# Altium project Acoustics Board.PrjPcb
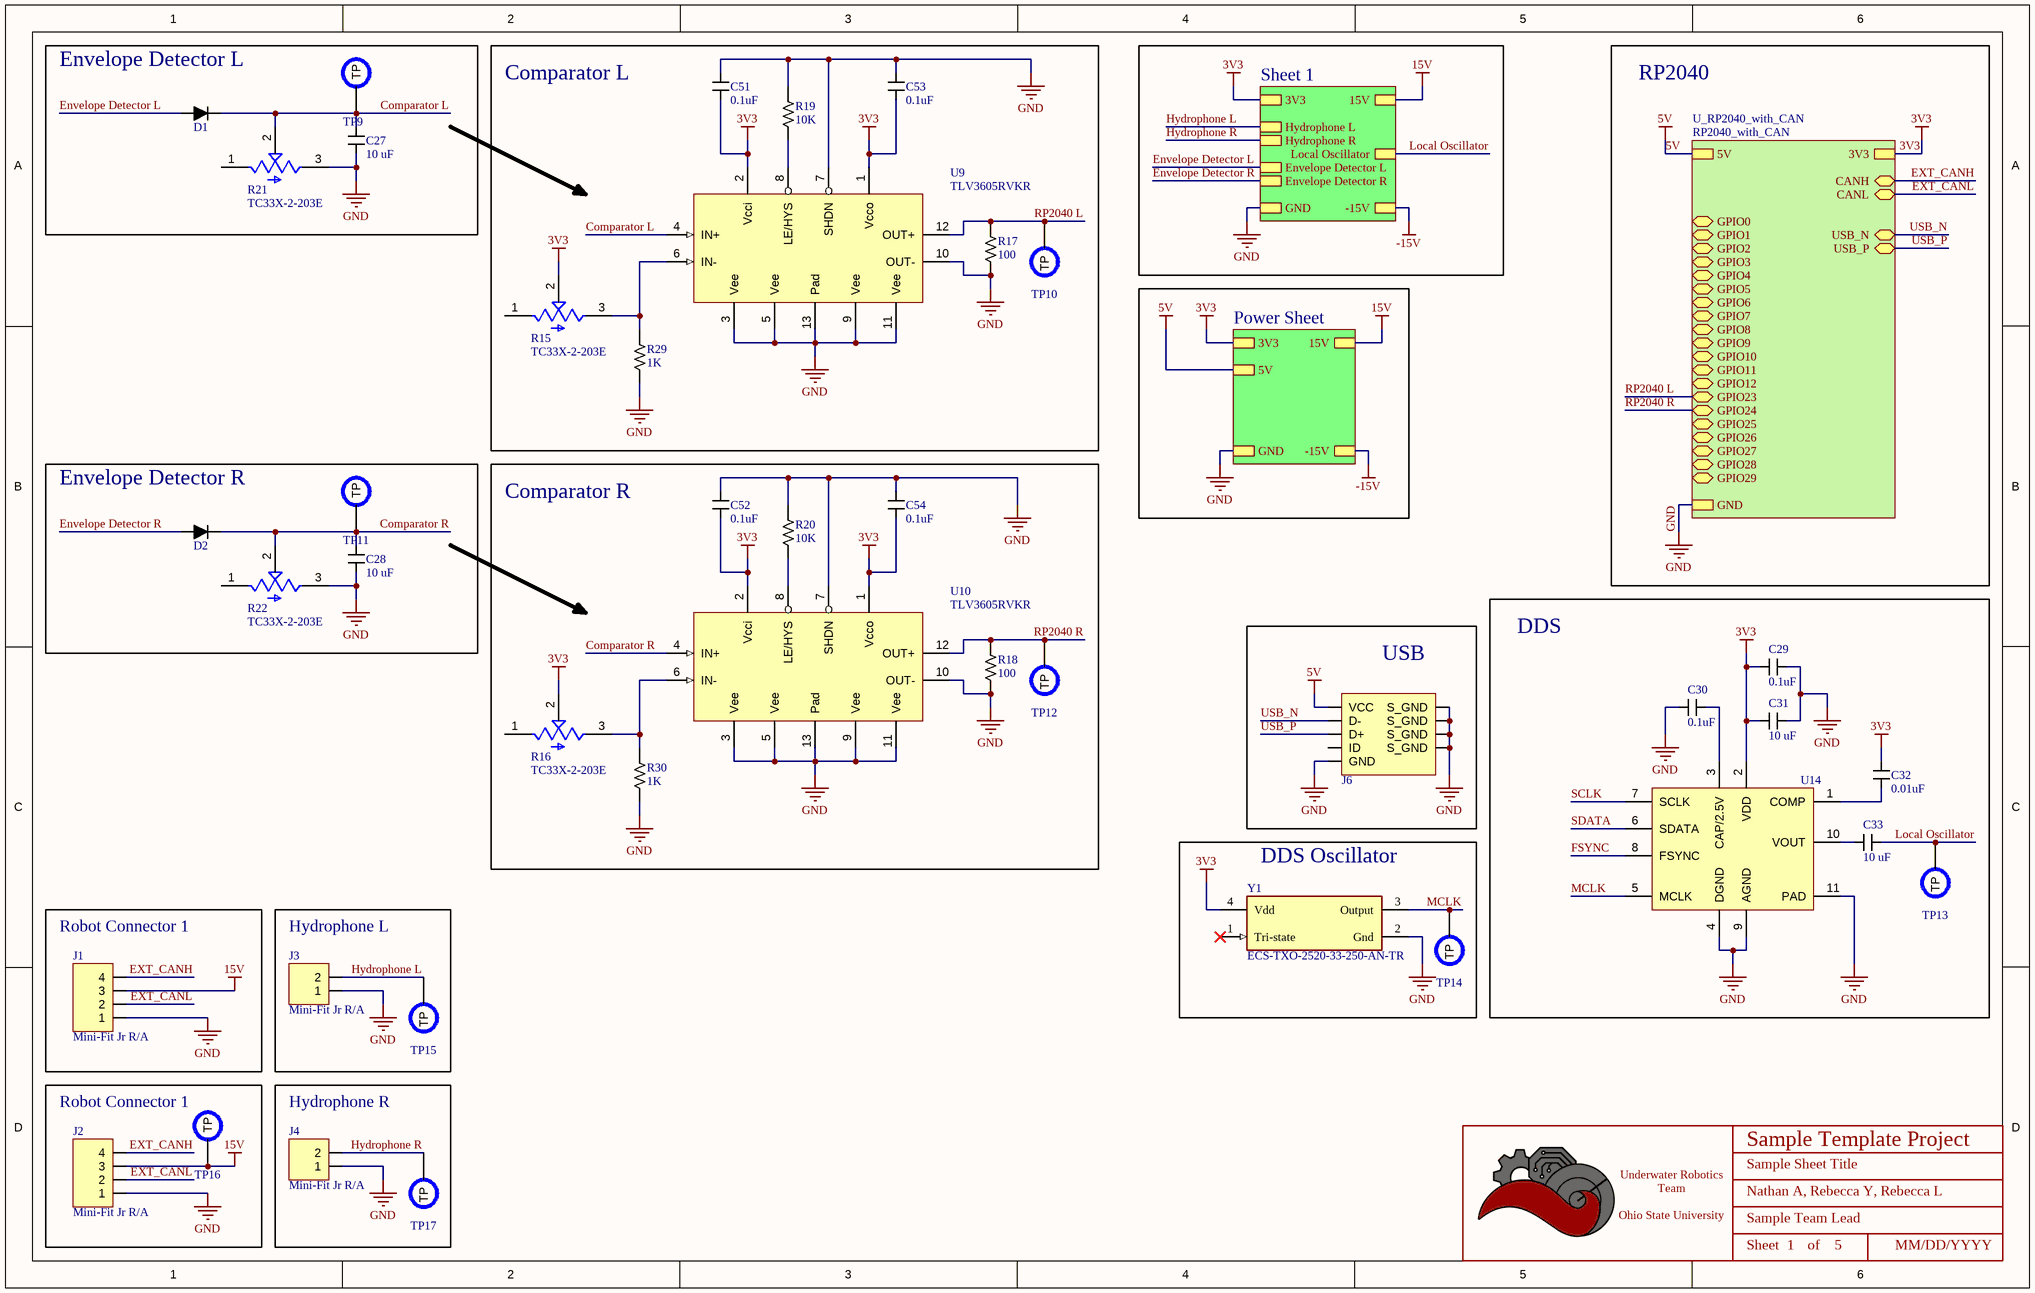
[diagram p0: Acoustics Board Pg. 2.SchDoc]
BoardRevision: 1.0; DateOfDesignReview: XX/XX/XXXX; ProjectTitle: Sample Template Project; TeamLead: Sample Team Lead
3 sheets, 145 parts. Net scope: strictly hierarchical (ports join the sheet entries above them; power ports are local).
Board file: Acoustics Board.PcbDoc
Sheets:
  Acoustics Board Pg. 2.SchDoc
    Sheet 1 = Acoustics Board Sheet 1.SchDoc
    Power Sheet = Acoustics Board Power.SchDoc

## Sheet Acoustics Board Pg. 2.SchDoc: Sample Sheet Title
size B; Date: MM/DD/YYYY; Author: Nathan A, Rebecca Y, Rebecca L; Organization: ORGANIZATION; Address1: ADDRESS 1; Address2: ADDRESS 2; Address3: ADDRESS 3; Address4: ADDRESS 4; Revision: -; SheetNumber: 1; SheetTotal: 5; ENG_APP_DATE: --/--/--; DSN_APP_DATE: --/--/--; CHK_APP_DATE: --/--/--

### Parts
(Parts that share a designator on the sheet are numbered #1, #2 ... from top to bottom, then left to right.)
*#1  Title_Block  [LOGO]  (value not drawn)  (graphical)
C27  Value (uF): 10 uF  [CAPACITOR_0603]  (hidden comment: 10uF Ceramic 6.3V)
C28  Value (uF): 10 uF  [CAPACITOR_0603]  (hidden comment: 10uF Ceramic 6.3V)
C29  value 0.1uF  [CAPACITOR_0603]  (hidden comment: 100nF Ceramic 6.3V)
C30  value 0.1uF  [CAPACITOR_0603]  (hidden comment: 100nF Ceramic 6.3V)
C31  Value (uF): 10 uF  [CAPACITOR_0603]  (hidden comment: 10uF Ceramic 6.3V)
C32  value 0.01uF  [CAPACITOR_0603]  (hidden comment: CL10B103KB8NNNC)
C33  Value (uF): 10 uF  [CAPACITOR_0603]  (hidden comment: 10uF Ceramic 6.3V)
C51  value 0.1uF  [CAPACITOR_0603]  (hidden comment: 100nF Ceramic 6.3V)
C52  value 0.1uF  [CAPACITOR_0603]  (hidden comment: 100nF Ceramic 6.3V)
C53  value 0.1uF  [CAPACITOR_0603]  (hidden comment: 100nF Ceramic 6.3V)
C54  value 0.1uF  [CAPACITOR_0603]  (hidden comment: 100nF Ceramic 6.3V)
D1  BAR9002ELE6327XTMA1  [DIODE_0402]  (value not drawn)
D2  BAR9002ELE6327XTMA1  [DIODE_0402]  (value not drawn)
J1  Mini-Fit Jr R/A  [CONN_MOLEX_MINIFIT JR_4 POS_R/A]
J2  Mini-Fit Jr R/A  [CONN_MOLEX_MINIFIT JR_4 POS_R/A]
J3  Mini-Fit Jr R/A  [CONN_MOLEX_MINIFIT JR_2 POS_R/A]
J4  Mini-Fit Jr R/A  [CONN_MOLEX_MINIFIT JR_2 POS_R/A]
J6  USB_MICRO R/A  [CONN_MINIUSB]  (value not drawn)
R15  TC33X-2-203E  [TRIM_TC33X-2-203E]
R16  TC33X-2-203E  [TRIM_TC33X-2-203E]
R17  Value  (Ohms): 100  [RESISTOR_0603]  (hidden comment: 100 Ohm 5% 1/8W)
R18  Value  (Ohms): 100  [RESISTOR_0603]  (hidden comment: 100 Ohm 5% 1/8W)
R19  Value  (Ohms): 10K  [RESISTOR_0603]  (hidden comment: 10k Ohm 5% 1/10W)
R20  Value  (Ohms): 10K  [RESISTOR_0603]  (hidden comment: 10k Ohm 5% 1/10W)
R21  TC33X-2-203E  [TRIM_TC33X-2-203E]
R22  TC33X-2-203E  [TRIM_TC33X-2-203E]
R29  Value  (Ohms): 1K  [RESISTOR_0603]  (hidden comment: 1k Ohm 5% 1/10W)
R30  Value  (Ohms): 1K  [RESISTOR_0603]  (hidden comment: 1k Ohm 5% 1/10W)
TP9  PCB Test Point  [TESTPOINT_1.2MM]  (value not drawn)  (no BOM)
TP10  PCB Test Point  [TESTPOINT_1.2MM]  (value not drawn)  (no BOM)
TP11  PCB Test Point  [TESTPOINT_1.2MM]  (value not drawn)  (no BOM)
TP12  PCB Test Point  [TESTPOINT_1.2MM]  (value not drawn)  (no BOM)
TP13  PCB Test Point  [TESTPOINT_1.2MM]  (value not drawn)  (no BOM)
TP14  PCB Test Point  [TESTPOINT_1.2MM]  (value not drawn)  (no BOM)
TP15  PCB Test Point  [TESTPOINT_1.2MM]  (value not drawn)  (no BOM)
TP16  PCB Test Point  [TESTPOINT_1.2MM]  (value not drawn)  (no BOM)
TP17  PCB Test Point  [TESTPOINT_1.2MM]  (value not drawn)  (no BOM)
U9  TLV3605RVKR  [TLV3605RVKR]
U10  TLV3605RVKR  [TLV3605RVKR]
U14  IC DDS 5MHZ 10BIT 10LFCSP  [CP-10-9]  (value not drawn)
Y1  ECS-TXO-2520-33-250-AN-TR  [FP-ECS-TXO-2520-MFG]

### Blocks framed on the sheet
Envelope Detector L: C27 D1 R21 TP9
Comparator L: C51 C53 R15 R17 R19 R29 TP10 U9
Envelope Detector R: C28 D2 R22 TP11
Comparator R: C52 C54 R16 R18 R20 R30 TP12 U10
DDS: C29-C33 TP13 U14
USB: J6
DDS Oscillator: TP14 Y1
Robot Connector 1: J1
Hydrophone L: J3 TP15
Robot Connector 1: J2 TP16
Hydrophone R: J4 TP17

### Sub-sheets
Power Sheet = Acoustics Board Power.SchDoc: 3V3, 15V, -15V, GND, 5V
Sheet 1 = Acoustics Board Sheet 1.SchDoc: Hydrophone L, Hydrophone R, Envelope Detector L, Envelope Detector R, 3V3, 15V, -15V, GND, Local Oscillator
U_RP2040_with_CAN = RP2040_with_CAN (file not in this document): USB_P (bidir), USB_N (bidir), 5V, CANH (bidir), CANL (bidir), GPIO0 (bidir), GPIO1 (bidir), GPIO2 (bidir), GPIO3 (bidir), GPIO4 (bidir), GPIO5 (bidir), GPIO6 (bidir), GPIO7 (bidir), GPIO8 (bidir), GPIO9 (bidir), GPIO10 (bidir), GPIO11 (bidir), GPIO12 (bidir), GPIO23 (bidir), GPIO24 (bidir), GPIO25 (bidir), GPIO26 (bidir), GPIO27 (bidir), GPIO28 (bidir), GPIO29 (bidir), 3V3, GND

### Nets
3V3: C29.2 C31.1 C32.1 C51.1 C52.1 C53.1 C54.1 R15.2(W) R16.2(W) U9.1(Vcco) U9.2(Vcci) U10.1(Vcco) U10.2(Vcci) U14.2(VDD) Y1.4(Vdd) ; sheet U_RP2040_with_CAN/3V3, sheet Sheet 1/3V3, sheet Power Sheet/3V3
5V: J6.1(VCC) ; sheet U_RP2040_with_CAN/5V, sheet Power Sheet/5V
15V: J1.3 J2.3 TP16.TP ; sheet Sheet 1/15V, sheet Power Sheet/15V
-15V: sheet Sheet 1/-15V, sheet Power Sheet/-15V
GND: C27.2 C28.2 C29.1 C30.1 C31.2 C51.2 C52.2 C53.2 C54.2 J1.1 J2.1 J3.1 J4.1 J6.5(GND) J6.6(S_GND) J6.7(S_GND) J6.8(S_GND) J6.9(S_GND) R17.2 R18.2 R19.1 R20.1 R21.3(CW) R22.3(CW) R29.2 R30.2 U9.3(Vee) U9.5(Vee) U9.7(SHDN) U9.9(Vee) U9.10(OUT-) U9.11(Vee) U9.13(Pad) U10.3(Vee) U10.5(Vee) U10.7(SHDN) U10.9(Vee) U10.10(OUT-) U10.11(Vee) U10.13(Pad) U14.4(DGND) U14.9(AGND) U14.11(PAD) Y1.2(Gnd) ; sheet U_RP2040_with_CAN/GND, sheet Sheet 1/GND, sheet Power Sheet/GND
Comparator L: C27.1 D1.2 R21.2(W) TP9.TP U9.4(IN+)
Comparator R: C28.1 D2.2 R22.2(W) TP11.TP U10.4(IN+)
Envelope Detector L: D1.1 ; sheet Sheet 1/Envelope Detector L
Envelope Detector R: D2.1 ; sheet Sheet 1/Envelope Detector R
EXT_CANH: J1.4 J2.4 ; sheet U_RP2040_with_CAN/CANH
EXT_CANL: J1.2 J2.2 ; sheet U_RP2040_with_CAN/CANL
FSYNC: U14.8(FSYNC)
Hydrophone L: J3.2 TP15.TP ; sheet Sheet 1/Hydrophone L
Hydrophone R: J4.2 TP17.TP ; sheet Sheet 1/Hydrophone R
Local Oscillator: C33.2 TP13.TP ; sheet Sheet 1/Local Oscillator
MCLK: TP14.TP U14.5(MCLK) Y1.3(Output)
RP2040 L: R17.1 TP10.TP U9.12(OUT+) ; sheet U_RP2040_with_CAN/GPIO23
RP2040 R: R18.1 TP12.TP U10.12(OUT+) ; sheet U_RP2040_with_CAN/GPIO24
SCLK: U14.7(SCLK)
SDATA: U14.6(SDATA)
USB_N: J6.2(D-) ; sheet U_RP2040_with_CAN/USB_N
USB_P: J6.3(D+) ; sheet U_RP2040_with_CAN/USB_P
NetC30_2: C30.2 U14.3(CAP/2.5V)
NetC32_2: C32.2 U14.1(COMP)
NetC33_1: C33.1 U14.10(VOUT)
NetR15_3: R15.3(CW) R29.1 U9.6(IN-)
NetR16_3: R16.3(CW) R30.1 U10.6(IN-)
NetR19_2: R19.2 U9.8(LE/HYS)
NetR20_2: R20.2 U10.8(LE/HYS)

Not connected (* = marked no-connect by the designer): J6 4(ID); R15 1(CCW); R16 1(CCW); R21 1(CCW); R22 1(CCW); Y1 1(Tri-state)*

### Notes on the sheet
- RP2040
- DWG. NO.
- REV.
- SHT.
- THIS DOCUMENT AND THE DATA DISCLOSED HEREIN OR HEREWITH IS THE PROPERTY OF ALTIUM LIMITED AND MAY BE FREELY DISTRIBUTED IN WHOLE. NO RIGHTS ARE RESERVED OR EXPRESS OR IMPLIED WARANTEE GIVEN.
- REVISION
- DESCRIPTION
- DATE
- APPROVED
- ENG:
- APPROVALS
- PROJECT
- DSN:
- CHK:
- REFERENCE DOCUMENTS
- PROJECT REVISION:
- TITLE
- DOCUMENT REVISION:
- DESIGN ITEM:
- BOM:
- FAB DWG:
- PCB DWG:
- ASSY DWG:
- SCALE:
- SIZE
- B
- CAGE CODE
- FILE NAME
- DWG NO.
- SHEET
- OF
- REV
- (in symbol Title_Block) Underwater Robotics Team / Ohio State University; Sheet; of

### Library data of the parts
*#1 = Title_Block: UWRT Schematic Title Block Template / Created June 2021, Dylan Trainor
C27 C28 C31 C33 = CAPACITOR_10uF_0603: Cap 10uF 6.3V +/-20% / Ceramic 0603; Made By: Flip B; ComponentLink1Description: Digikey; ComponentLink1URL: https://www.digikey.com/en/products/detail/samsung-electro-mechanics/CL10A106MQ8NNNC/3886777; Supplier 1: Digi-Key; Supplier Part Number 1: 1276-1119-1-ND; Tolerance: +/- 20%; Voltage: 6.3V
C29 C30 C51-C54 = CAPACITOR_0.1uF_0603: Cap 100nF 6.3V +/-10% / Ceramic 0603; Made By: Flip B; ComponentLink1Description: Datsheet; ComponentLink1URL: https://www.mouser.com/datasheet/2/212/KEM_C1002_X7R_SMD-1102033.pdf; Tolerance: +/- 10%; Voltage: 6.3V; Supplier 1: Digi-Key; Supplier Part Number 1: 399-15351-1-ND
C32 = CAPACITOR_0.01uF_0603_50V: 10000 pF ±10% 50V Ceramic Capacitor X7R 0603 (1608 Metric); Tolerance: +/- 10%; Voltage: 6.3V; Made By: Flip B; ComponentLink1Description: Datsheet; ComponentLink1URL: https://www.mouser.com/datasheet/2/212/KEM_C1002_X7R_SMD-1102033.pdf; Supplier 1: Arrow Electronics; Supplier Part Number 1: CL10B103KB8NNNC
D1 D2 = RF Diode 80V 100mA: RF Diode PIN - Single 80V 100 mA 250 mW PG-TSLP-2-19; Forward Current: 100mA; Voltage - Peak Reverse: 80V; Package: 0402
J1 J2 = CONN_MOLEX_MINIFIT JR_4POS_R/A: Molex Minifit Jr. 5569 / 4 Pos R/A Natural; Pitch: 4.2mm; Configuration: Right Angle; Current Per Pin: 13A; Number of Positions: 4; Supplier Part Number 1: WM13112-ND; Supplier 1: Digi-Key; Manufacturer: Molex; Color: Natural; Created By: Flip B; ComponentLink1Description: Datasheet; ComponentLink1URL: https://www.molex.com/pdm_docs/sd/026013115_sd.pdf; Series: Minifit Jr 5569
J3 J4 = CONN_MOLEX_MINIFIT JR_2POS_R/A: Molex Minifit Jr. 5569 / 2 Pos R/A Natural; Pitch: 4.2mm; Configuration: Right Angle; Current Per Pin: 13A; Number of Positions: 2; Manufacturer: Molex; Color: Natural; Created By: Robert P; ComponentLink1Description: Datasheet; ComponentLink1URL: https://www.molex.com/pdm_docs/sd/026013115_sd.pdf; Series: Minifit Jr 5569; Supplier 1: Digi-Key; Supplier Part Number 1: WM1351-ND
J6 = CONN_MICROUSB: Amphenol Micro USB-B / USB2.0 5 Pin Right Angle SMD; Pitch: 0.65mm; Current Per Pin: 1.8A; Number of Positions: 5; Manufacturer: Amphenol; Configuration: Right Angle; Color: Silver; Created By: Flip B; ComponentLink1Description: Datasheet; ComponentLink1URL: https://cdn.amphenol-icc.com/media/wysiwyg/files/documentation/datasheet/inputoutput/io_usb_micro.pdf?__cf_chl_jschl_tk__=05693735e19256298f6ef6ca2bb2e65c376a4f56-1625503833-0-Abitsb0-ufjOXJYs_S3J3r2iTn-nObalbmXUksF1VvO_h_WEmRdMlUD1I8-hmWSEVWzY1pirKnrPZWfgY3851qyBZe5ZvnNQePLGIzUgdEIQBVUyW36RsbYpDLEWxJ4horD-5gChFgobLYqwmG5aHl0E8lIn_twwPPrOxilK2gP0q9t_CNOs_u5fMqXvXUrlsOv8tIE2NRlu6NVP8qtkL2GjhlkeTUbDMF8WvvpPDTFOgvZ4Y16Ej8F8AhWos88mo5B1HssXozw0XrkJQIqERITUu6rqloz9kf4ZzhBHtDAt-IkiAFY_Ds9SW8FYKKTtINJVpHZQ6Gyu1FFM4Dc9MO0maE8_mmNcwlxqyRoRk_MPWW8VyByXWM5RSp52jteRKw7FeI9WIYvCbPAOy0Eyib-aseIQsnGbglBcUY6_2xp8GYaJM38H3dNvBPsSOfJBPndKedwKHllxjkucXn6xsN0sDXkpGN-cu8_2bDTJ0g-uUucKSCooYX-ApSDNGpkA_p9zv1SOAD8c0zaZVmtiBsN75QpVz2rzq9_BFxOywPvR; Series: 10118192; Supplier 1: Digi-Key; Supplier Part Number 1: 609-4613-1-ND
R15 R16 R21 R22 = TC33X-2-203E: 20 kOhms 0.1W, 1/10W J Lead Surface Mount Trimmer Potentiometer Cermet 1 Turn Top Adjustment; MF: Bourns; Value: *; SnapEDA_Link: https://www.snapeda.com/parts/TC33X-2-203E/Bourns/view-part/312812/?ref=snap; Check_prices: https://www.snapeda.com/parts/TC33X-2-203E/Bourns/view-part/312812/?ref=eda; Digi-Key_Part_Number: TC33X-2-203ECT-ND; Purchase-URL: https://pricing.snapeda.com/search/part/TC33X-2-203E/?ref=eda; Package: 1608 Bourns; MP: TC33X-2-203E
R17 R18 = RESISTOR_100_0603_1: RES 100 OHM 5% 1/8W 0603; Tolerance: +/- 5%; Made By: Flip B; ComponentLink1Description: Digikey; ComponentLink1URL: https://www.digikey.com/en/products/detail/koa-speer-electronics-inc/RK73B1JTTD101J/9844701; Wattage: 1/8W
R19 R20 = RESISTOR_10K_0603: RES 10k OHM 5% 1/10W 0603; Tolerance: +/- 5%; Wattage: 1/8W; Made By: Robert Pafford; ComponentLink1Description: Datasheet; ComponentLink1URL: https://www.bourns.com/docs/product-datasheets/CRxxxxx.pdf; Supplier: Digikey; Digikey Part Numer: CR0603-JW-104ELFTR-ND; Supplier 1: Digi-Key; Supplier Part Number 1: 2019-RK73B1JTTD103JCT-ND
R29 R30 = RESISTOR_1K_0.5%_0603: RES 1k OHM 0.5% 1/10W 0603; Tolerance: +/- 0.5%; Made By: Robert Pafford; Wattage: 1/10W; Supplier: Digikey; Digikey Part Numer: CR0603-JW-104ELFTR-ND; Supplier 1: Digi-Key; Supplier Part Number 1: 749-1693-1-ND
TP9-TP17 = TESTPOINT: Made By: Robert Pafford
U9 U10 = TLV3605RVKR: IC COMPARATOR 1 GEN PUR 12WQFN; Manufacturer: Texas Instruments; Supply Voltage: 2.4V ~ 5.5V; PartNumber: TLV3605RVKR; Created By: Nathan Ayer; ComponentLink1Description: Digi-Key; ComponentLink1URL: https://www.digikey.com/en/products/detail/texas-instruments/TLV3605RVKR/14123952
U14 = AD9837ACPZ: Direct Digital Synthesis IC 10 b 5 MHz 28 b Tuning 10-LFCSP-WD (3x3)
Y1 = CMP-40224-000034-1: XTAL OSC TCXO 25.0000MHZ HCMOS; RoHS Compliant: Yes

## Sheet Acoustics Board Sheet 1.SchDoc: Sample Sheet Title
size B; Date: 10/22/2023; Author: Sample Author; Organization: ORGANIZATION; Address1: ADDRESS 1; Address2: ADDRESS 2; Address3: ADDRESS 3; Address4: ADDRESS 4; Revision: -; SheetNumber: 2; SheetTotal: 5; ENG_APP_DATE: --/--/--; DSN_APP_DATE: --/--/--; CHK_APP_DATE: --/--/--
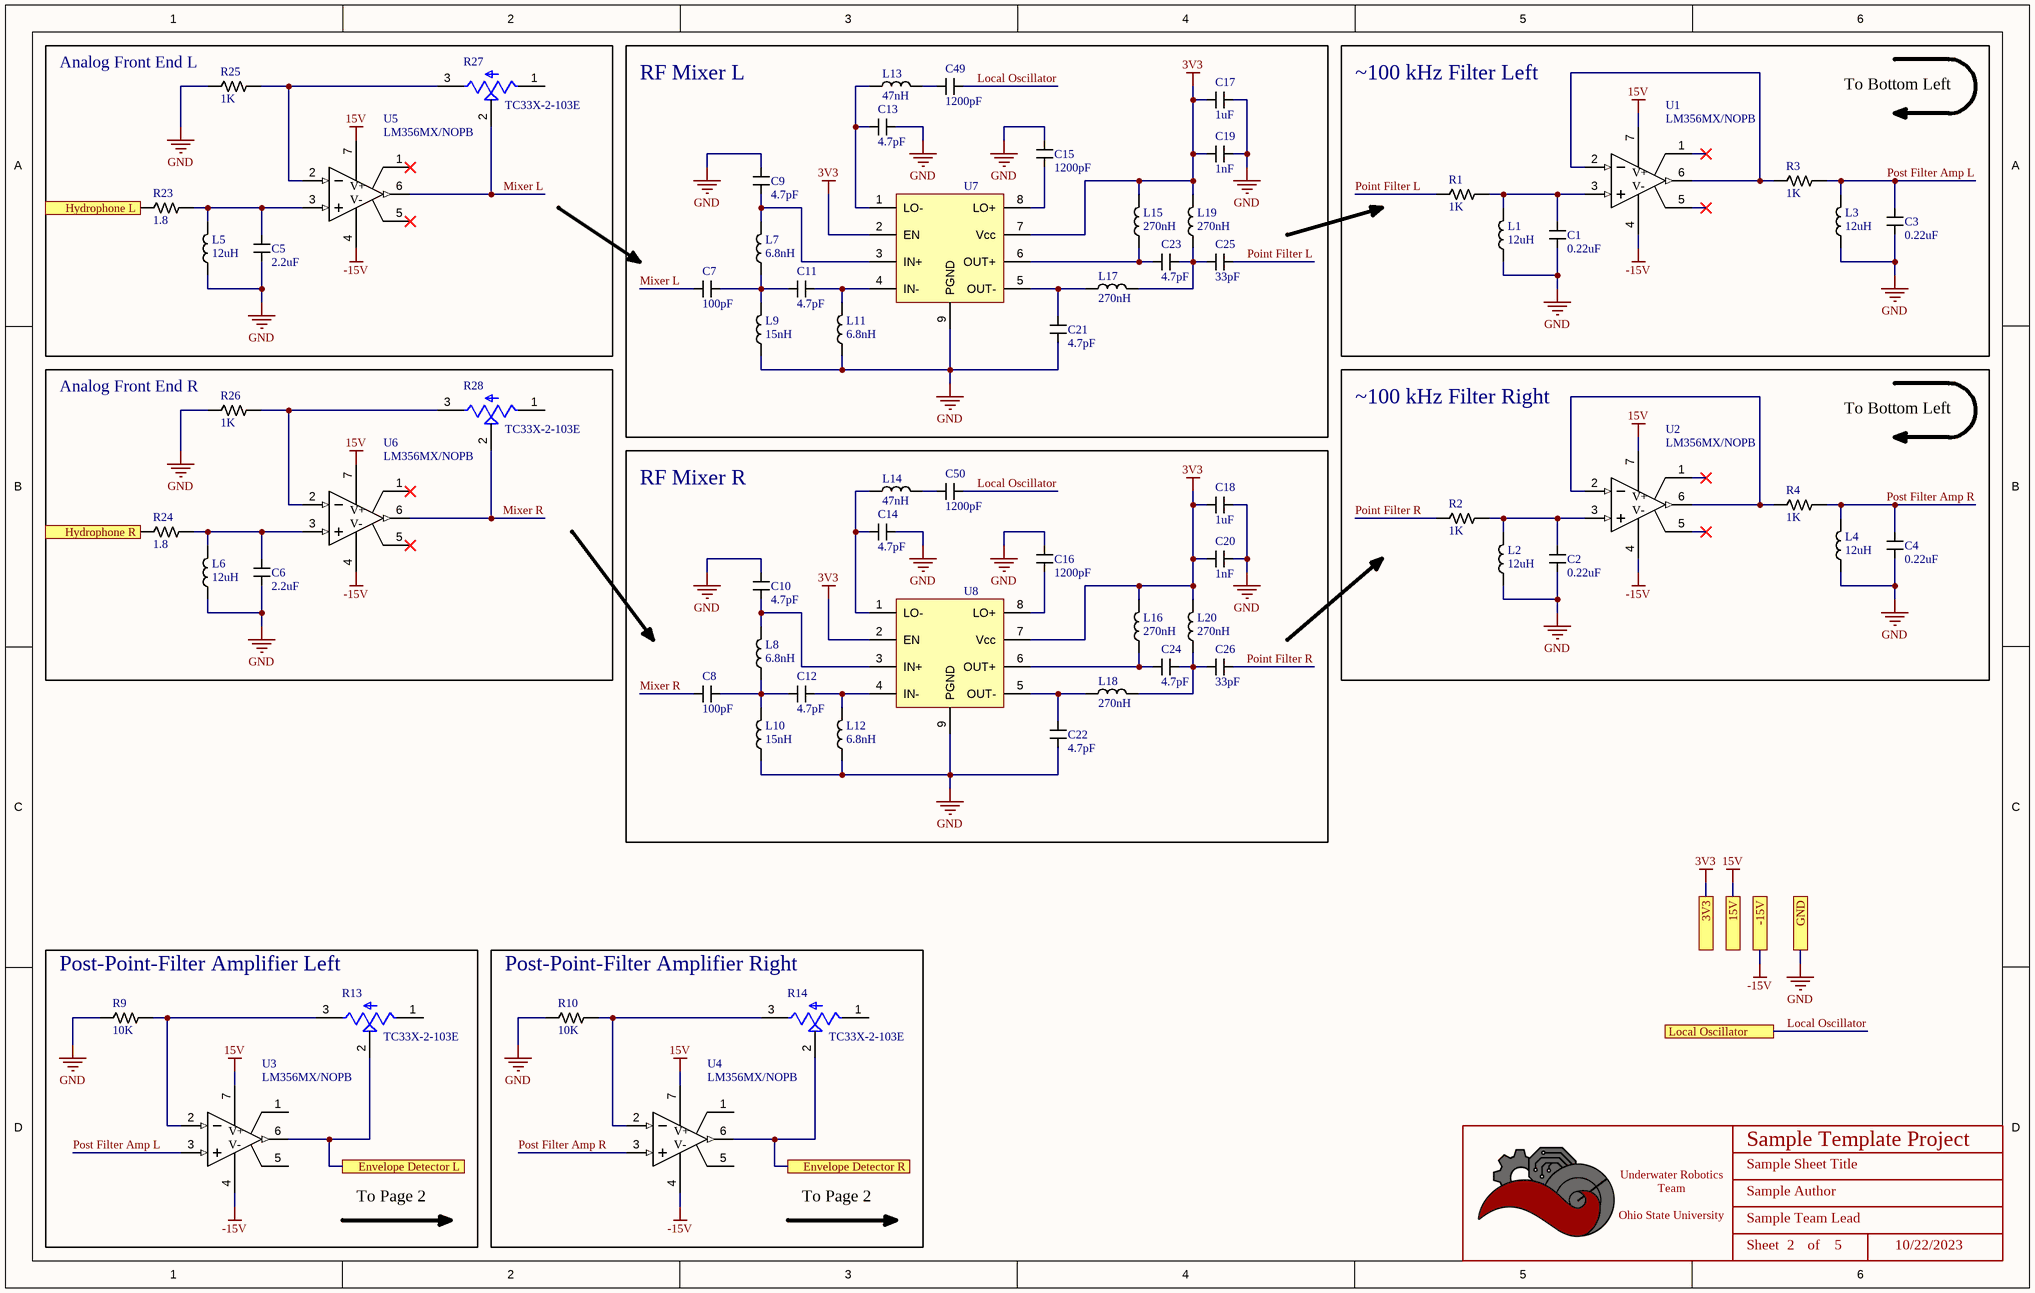
[diagram p1: Acoustics Board Sheet 1.SchDoc]

### Parts
(Parts that share a designator on the sheet are numbered #1, #2 ... from top to bottom, then left to right.)
*#2  Title_Block  [LOGO]  (value not drawn)  (graphical)
C1  value 0.22uF  [CAPACITOR_0603]  (hidden comment: 0.22uF Ceramic 16V)
C2  value 0.22uF  [CAPACITOR_0603]  (hidden comment: 0.22uF Ceramic 16V)
C3  value 0.22uF  [CAPACITOR_0603]  (hidden comment: 0.22uF Ceramic 16V)
C4  value 0.22uF  [CAPACITOR_0603]  (hidden comment: 0.22uF Ceramic 16V)
C5  value 2.2uF  [CAPACITOR_0603]  (hidden comment: 22uF Ceramic)
C6  value 2.2uF  [CAPACITOR_0603]  (hidden comment: 22uF Ceramic)
C7  value 100pF  [CAPACITOR_0402]  (hidden comment: 100pF Ceramic 25V)
C8  value 100pF  [CAPACITOR_0402]  (hidden comment: 100pF Ceramic 25V)
C9  value 4.7pF  [CAPACITOR_0402]  (hidden comment: CAP CER 4.7PF 50V C0G/NP0 0402)
C10  value 4.7pF  [CAPACITOR_0402]  (hidden comment: CAP CER 4.7PF 50V C0G/NP0 0402)
C11  value 4.7pF  [CAPACITOR_0402]  (hidden comment: CAP CER 4.7PF 50V C0G/NP0 0402)
C12  value 4.7pF  [CAPACITOR_0402]  (hidden comment: CAP CER 4.7PF 50V C0G/NP0 0402)
C13  value 4.7pF  [CAPACITOR_0402]  (hidden comment: CAP CER 4.7PF 50V C0G/NP0 0402)
C14  value 4.7pF  [CAPACITOR_0402]  (hidden comment: CAP CER 4.7PF 50V C0G/NP0 0402)
C15  value 1200pF  [CAPACITOR_0402]  (hidden comment: 1200pF Ceramic 50V)
C16  value 1200pF  [CAPACITOR_0402]  (hidden comment: 1200pF Ceramic 50V)
C17  value 1uF  [CAPACITOR_0603]  (hidden comment: 1uF Ceramic 25V)
C18  value 1uF  [CAPACITOR_0603]  (hidden comment: 1uF Ceramic 25V)
C19  value 1nF  [CAPACITOR_0603]  (hidden comment: 1000pF Ceramic 50V)
C20  value 1nF  [CAPACITOR_0603]  (hidden comment: 1000pF Ceramic 50V)
C21  value 4.7pF  [CAPACITOR_0402]  (hidden comment: CAP CER 4.7PF 50V C0G/NP0 0402)
C22  value 4.7pF  [CAPACITOR_0402]  (hidden comment: CAP CER 4.7PF 50V C0G/NP0 0402)
C23  value 4.7pF  [CAPACITOR_0402]  (hidden comment: CAP CER 4.7PF 50V C0G/NP0 0402)
C24  value 4.7pF  [CAPACITOR_0402]  (hidden comment: CAP CER 4.7PF 50V C0G/NP0 0402)
C25  value 33pF  [CAPACITOR_0603]  (hidden comment: CAP CER 33PF 250V C0G/NP0 0603)
C26  value 33pF  [CAPACITOR_0603]  (hidden comment: CAP CER 33PF 250V C0G/NP0 0603)
C49  value 1200pF  [CAPACITOR_0402]  (hidden comment: 1200pF Ceramic 50V)
C50  value 1200pF  [CAPACITOR_0402]  (hidden comment: 1200pF Ceramic 50V)
L1  value 12uH  [INDUCTOR_0603]  (hidden comment: FIXED IND 12UH 10MA 1.8 OHM SMD)
L2  value 12uH  [INDUCTOR_0603]  (hidden comment: FIXED IND 12UH 10MA 1.8 OHM SMD)
L3  value 12uH  [INDUCTOR_0603]  (hidden comment: FIXED IND 12UH 10MA 1.8 OHM SMD)
L4  value 12uH  [INDUCTOR_0603]  (hidden comment: FIXED IND 12UH 10MA 1.8 OHM SMD)
L5  value 12uH  [INDUCTOR_0603]  (hidden comment: FIXED IND 12UH 10MA 1.8 OHM SMD)
L6  value 12uH  [INDUCTOR_0603]  (hidden comment: FIXED IND 12UH 10MA 1.8 OHM SMD)
L7  value 6.8nH  [INDUCTOR_0402]  (hidden comment: FIXED IND 6.8NH 250MA 320MOHM SM)
L8  value 6.8nH  [INDUCTOR_0402]  (hidden comment: FIXED IND 6.8NH 250MA 320MOHM SM)
L9  value 15nH  [INDUCTOR_0402]  (hidden comment: FIXED IND 15NH 250MA 600MOHM SMD)
L10  value 15nH  [INDUCTOR_0402]  (hidden comment: FIXED IND 15NH 250MA 600MOHM SMD)
L11  value 6.8nH  [INDUCTOR_0402]  (hidden comment: FIXED IND 6.8NH 250MA 320MOHM SM)
L12  value 6.8nH  [INDUCTOR_0402]  (hidden comment: FIXED IND 6.8NH 250MA 320MOHM SM)
L13  value 47nH  [INDUCTOR_0402]  (hidden comment: FIXED IND 47NH 200MA 1.1 OHM SMD)
L14  value 47nH  [INDUCTOR_0402]  (hidden comment: FIXED IND 47NH 200MA 1.1 OHM SMD)
L15  value 270nH  [INDUCTOR_0402]  (hidden comment: FIXED IND 270NH 110MA 4.94OHM SM)
L16  value 270nH  [INDUCTOR_0402]  (hidden comment: FIXED IND 270NH 110MA 4.94OHM SM)
L17  value 270nH  [INDUCTOR_0402]  (hidden comment: FIXED IND 270NH 110MA 4.94OHM SM)
L18  value 270nH  [INDUCTOR_0402]  (hidden comment: FIXED IND 270NH 110MA 4.94OHM SM)
L19  value 270nH  [INDUCTOR_0402]  (hidden comment: FIXED IND 270NH 110MA 4.94OHM SM)
L20  value 270nH  [INDUCTOR_0402]  (hidden comment: FIXED IND 270NH 110MA 4.94OHM SM)
R1  Value  (Ohms): 1K  [RESISTOR_0603]  (hidden comment: 1.45k Ohm 0.1% 1/10W)
R2  Value  (Ohms): 1K  [RESISTOR_0603]  (hidden comment: 1.45k Ohm 0.1% 1/10W)
R3  Value  (Ohms): 1K  [RESISTOR_0603]  (hidden comment: 1.45k Ohm 0.1% 1/10W)
R4  Value  (Ohms): 1K  [RESISTOR_0603]  (hidden comment: 1.45k Ohm 0.1% 1/10W)
R9  Value  (Ohms): 10K  [RESISTOR_0603]  (hidden comment: 10k Ohm 0.5% 1/10W)
R10  Value  (Ohms): 10K  [RESISTOR_0603]  (hidden comment: 10k Ohm 0.5% 1/10W)
R13  TC33X-2-103E  [TRIM_TC33X-2-203E]
R14  TC33X-2-103E  [TRIM_TC33X-2-203E]
R23  Value  (Ohms): 1.8  [RESISTOR_0402]  (hidden comment: 2k Ohm 1% 1/16W)
R24  Value  (Ohms): 1.8  [RESISTOR_0402]  (hidden comment: 2k Ohm 1% 1/16W)
R25  Value  (Ohms): 1K  [RESISTOR_0603]  (hidden comment: 1k Ohm 5% 1/8W)
R26  Value  (Ohms): 1K  [RESISTOR_0603]  (hidden comment: 1k Ohm 5% 1/8W)
R27  TC33X-2-103E  [TRIM_TC33X-2-203E]
R28  TC33X-2-103E  [TRIM_TC33X-2-203E]
U1  LM356MX/NOPB  [SOIC-8]
U2  LM356MX/NOPB  [SOIC-8]
U3  LM356MX/NOPB  [SOIC-8]
U4  LM356MX/NOPB  [SOIC-8]
U5  LM356MX/NOPB  [SOIC-8]
U6  LM356MX/NOPB  [SOIC-8]
U7  LT5560EDD  [LT5560EDD]  (value not drawn)
U8  LT5560EDD  [LT5560EDD]  (value not drawn)

### Blocks framed on the sheet
Analog Front End L: C5 L5 R23 R25 R27 U5
RF Mixer L: C7 C9 C11 C13 C15 C17 C19 C21 C23 C25 C49 L7 L9 L11 L13 L15 L17 L19 U7
~100 kHz Filter Left: C1 C3 L1 L3 R1 R3 U1
Analog Front End R: C6 L6 R24 R26 R28 U6
~100 kHz Filter Right: C2 C4 L2 L4 R2 R4 U2
RF Mixer R: C8 C10 C12 C14 C16 C18 C20 C22 C24 C26 C50 L8 L10 L12 L14 L16 L18 L20 U8
Post-Point-Filter Amplifier Left: R9 R13 U3
Post-Point-Filter Amplifier Right: R10 R14 U4

### Ports
3V3, 15V, -15V, Envelope Detector L, Envelope Detector R, GND, Hydrophone L, Hydrophone R, Local Oscillator

### Nets
3V3: C17.2 C18.2 C19.2 C20.2 L15.1 L16.1 L19.1 L20.1 U7.2(EN) U7.7(Vcc) U8.2(EN) U8.7(Vcc) ; port 3V3
15V: U1.7(V+) U2.7(V+) U3.7(V+) U4.7(V+) U5.7(V+) U6.7(V+) ; port 15V
-15V: U1.4(V-) U2.4(V-) U3.4(V-) U4.4(V-) U5.4(V-) U6.4(V-) ; port -15V
GND: C1.2 C2.2 C3.2 C4.2 C5.2 C6.2 C9.1 C10.1 C13.1 C14.1 C15.1 C16.1 C17.1 C18.1 C19.1 C20.1 C21.2 C22.2 L1.2 L2.2 L3.2 L4.2 L5.2 L6.2 L9.2 L10.2 L11.2 L12.2 R9.2 R10.2 R25.2 R26.2 U7.9(PGND) U8.9(PGND) ; port GND
Envelope Detector L: R13.2(W) U3.6(OUT) ; port Envelope Detector L
Envelope Detector R: R14.2(W) U4.6(OUT) ; port Envelope Detector R
Hydrophone L: R23.2 ; port Hydrophone L
Hydrophone R: R24.2 ; port Hydrophone R
Local Oscillator: C49.1 C50.1 ; port Local Oscillator
Mixer L: C7.1 R27.2(W) U5.6(OUT)
Mixer R: C8.1 R28.2(W) U6.6(OUT)
Point Filter L: C25.1 R1.2
Point Filter R: C26.1 R2.2
Post Filter Amp L: C3.1 L3.1 R3.1 U3.3(IN+)
Post Filter Amp R: C4.1 L4.1 R4.1 U4.3(IN+)
NetC1_1: C1.1 L1.1 R1.1 U1.3(IN+)
NetC2_1: C2.1 L2.1 R2.1 U2.3(IN+)
NetC5_1: C5.1 L5.1 R23.1 U5.3(IN+)
NetC6_1: C6.1 L6.1 R24.1 U6.3(IN+)
NetC7_2: C7.2 C11.2 L7.2 L9.1
NetC8_2: C8.2 C12.2 L8.2 L10.1
NetC9_2: C9.2 L7.1 U7.3(IN+)
NetC10_2: C10.2 L8.1 U8.3(IN+)
NetC11_1: C11.1 L11.1 U7.4(IN-)
NetC12_1: C12.1 L12.1 U8.4(IN-)
NetC13_2: C13.2 L13.2 U7.1(LO-)
NetC14_2: C14.2 L14.2 U8.1(LO-)
NetC15_2: C15.2 U7.8(LO+)
NetC16_2: C16.2 U8.8(LO+)
NetC21_1: C21.1 L17.2 U7.5(OUT-)
NetC22_1: C22.1 L18.2 U8.5(OUT-)
NetC23_1: C23.1 C25.2 L17.1 L19.2
NetC23_2: C23.2 L15.2 U7.6(OUT+)
NetC24_1: C24.1 C26.2 L18.1 L20.2
NetC24_2: C24.2 L16.2 U8.6(OUT+)
NetC49_2: C49.2 L13.1
NetC50_2: C50.2 L14.1
NetR3_2: R3.2 U1.2(IN-) U1.6(OUT)
NetR4_2: R4.2 U2.2(IN-) U2.6(OUT)
NetR9_1: R9.1 R13.3(CW) U3.2(IN-)
NetR10_1: R10.1 R14.3(CW) U4.2(IN-)
NetR25_1: R25.1 R27.3(CW) U5.2(IN-)
NetR26_1: R26.1 R28.3(CW) U6.2(IN-)

Not connected (* = marked no-connect by the designer): R13 1(CCW); R14 1(CCW); R27 1(CCW); R28 1(CCW); U1 1(Balance)* 5(Balance)*; U2 1(Balance)* 5(Balance)*; U3 1(Balance) 5(Balance); U4 1(Balance) 5(Balance); U5 1(Balance)* 5(Balance)*; U6 1(Balance)* 5(Balance)*

### Notes on the sheet
- To Bottom Left
- To Page 2
- DWG. NO.
- REV.
- SHT.
- THIS DOCUMENT AND THE DATA DISCLOSED HEREIN OR HEREWITH IS THE PROPERTY OF ALTIUM LIMITED AND MAY BE FREELY DISTRIBUTED IN WHOLE. NO RIGHTS ARE RESERVED OR EXPRESS OR IMPLIED WARANTEE GIVEN.
- REVISION
- DESCRIPTION
- DATE
- APPROVED
- ENG:
- APPROVALS
- PROJECT
- DSN:
- CHK:
- REFERENCE DOCUMENTS
- PROJECT REVISION:
- TITLE
- DOCUMENT REVISION:
- DESIGN ITEM:
- BOM:
- FAB DWG:
- PCB DWG:
- ASSY DWG:
- SCALE:
- SIZE
- B
- CAGE CODE
- FILE NAME
- DWG NO.
- SHEET
- OF
- REV
- (in symbol Title_Block) Underwater Robotics Team / Ohio State University; Sheet; of

### Library data of the parts
*#2 = Title_Block: as *#1 on sheet Acoustics Board Pg. 2
C1-C4 = CAPACITOR_0.000027uF_0603: CAP CER 0.22uF 16V X7R 0603; Tolerance: +/- 5%; Made By: Nathan Ayer; Voltage: 16V; ComponentLink2Description: Digikey; ComponentLink2URL: https://www.digikey.com/en/products/detail/yageo/CC0603JRX7R7BB224/5883645
C5 C6 = CAPACITOR_22uF_0603: CAP CER 2.2PF 50V C0G/NP0 0603; Tolerance: +/- 20%; Voltage: 6.3V; Made By: Flip B; Supplier 1: Digi-Key; Supplier Part Number 1: 445-8028-1-ND
C7 C8 = CAPACITOR_0.0001uF_0402: Cap 100pF 25V +/-10% / Ceramic 0402; Made By: Robert Pafford; Tolerance: +/- 10%; Voltage: 25V; Supplier 1: Digikey; Supplier Part Number 1: 399-C0402C101K3GAC7867CT-ND
C9-C14 C21-C24 = CAPACITOR_0.000015uF_0402: 4.7 pF ±0.1pF 50V Ceramic Capacitor C0G, NP0 0402 (1005 Metric); Tolerance: +/- 0.1 pF; Voltage: 50V
C15 C16 C49 C50 = CAPACITOR_0.0012uF_0402: CAP CER 1200PF 50V X7R 0402; Tolerance: +/- 5%; Made By: Robert Pafford; Voltage: 50V; Supplier 1: Future Electronics; Supplier Part Number 1: 5334081
C17 C18 = CAPACITOR_1uF_0603_25V: Cap 1uF 25V +/-10% / Ceramic 0603; Voltage: 16V; Made By: Flip B; Tolerance: +/- 10%; Supplier 1: Future Electronics; Supplier Part Number 1: 5636071
C19 C20 = CAPACITOR_0.001uF_0603: Cap 1000pF 50V +/-2% / Ceramic 0603; Voltage: 50; Made By: Flip B; ComponentLink1Description: Datsheet; ComponentLink1URL: https://datasheets.avx.com/C0GNP0-Dielectric.pdf; Tolerance: +/- 2%; Supplier 1: Arrow Electronics; Supplier Part Number 1: C0603C102K5RACTU
C25 C26 = CAPACITOR_0.001uF_0603: 33 pF ±5% 250V Ceramic Capacitor C0G, NP0 0603 (1608 Metric); Tolerance: +/- 5%; ComponentLink1Description: Datsheet; ComponentLink1URL: https://datasheets.avx.com/C0GNP0-Dielectric.pdf; Voltage: 250V
L1-L4 = INDUCTOR_12uH_0603: 12 µH Shielded Multilayer Inductor 10 mA 1.8Ohm Max 0603 (1608 Metric); Tolerance: +/- 5%; Made By: Nathan Ayer; DC Resistance: 1.8Ohm; Current Rating: 10mA; ComponentLink1Description: Digikey; ComponentLink1URL: https://www.digikey.com/en/products/detail/tdk-corporation/MLF1608E120JTD25/4743066
L5 L6 = INDUCTOR_12uH_0603: 12 µH Shielded Multilayer Inductor 10 mA 1.8Ohm Max 0603 (1608 Metric); Tolerance: +/- 20%; Made By: Robert Pafford; DC Resistance: 36mOhm; Current Rating: 2.1A; Supplier 1: Arrow Electronics; Supplier Part Number 1: MLF1608E120JTD25
L7 L8 L11 L12 = INDUCTOR_15nH_0402: 6.8 nH Unshielded Multilayer Inductor 250 mA 320mOhm Max 0402 (1005 Metric); Tolerance: +/- 5%
L9 L10 = INDUCTOR_15nH_0402: 15 nH Unshielded Multilayer Inductor 250 mA 600mOhm Max 0402 (1005 Metric); Tolerance: +/- 5%
L13 L14 = INDUCTOR_15nH_0402: 47 nH Unshielded Multilayer Inductor 200 mA 1.1Ohm Max 0402 (1005 Metric); Tolerance: +/- 5%
L15-L20 = INDUCTOR_15nH_0402: 270 nH Unshielded Multilayer Inductor 110 mA 4.94Ohm Max 0402 (1005 Metric); Tolerance: +/- 10%
R1-R4 = RESISTOR_1K_0603: RES 1.45K OHM 0.1% 1/10W 0603; Tolerance: +/- 0.1%; Made By: Nathan Ayer; ComponentLink1Description: Digikey; ComponentLink1URL: https://www.digikey.com/en/products/detail/koa-speer-electronics-inc/RN73H1JTTD1451B50/10688964; Wattage: 1/10W; Supplier: Digikey; Digikey Part Numer: CR0603-JW-104ELFTR-ND
R9 R10 = RESISTOR_10K_0.5%_0603: RES 10k OHM 0.5% 1/10W 0603; Tolerance: +/- 0.5%; Made By: Robert Pafford; Wattage: 1/10W; Supplier: Digikey; Digikey Part Numer: CR0603-JW-104ELFTR-ND; Supplier 1: Digi-Key; Supplier Part Number 1: 749-1695-1-ND
R13 R14 R27 R28 = TC33X-2-203E: as R15 on sheet Acoustics Board Pg. 2; Value: *; Digi-Key_Part_Number: TC33X-2-203ECT-ND; Package: 1608 Bourns; MP: TC33X-2-203E; SnapEDA_Link: https://www.snapeda.com/parts/TC33X-2-203E/Bourns/view-part/312812/?ref=snap; Check_prices: https://www.snapeda.com/parts/TC33X-2-203E/Bourns/view-part/312812/?ref=eda; Purchase-URL: https://pricing.snapeda.com/search/part/TC33X-2-203E/?ref=eda
R23 R24 = RESISTOR_2K_0402: RES 2k OHM 1% 1/16W 0402; Tolerance: +/- 1%; Made By: Flip B; Wattage: 1/16W; Supplier 1: Digi-Key; Supplier Part Number 1: 311-2KLRCT-ND
R25 = RESISTOR_1K_0603: RES 1.8 OHM 5% 1/8W 0603; Tolerance: +/- 5%; Made By: Robert Pafford; ComponentLink1Description: Datasheet; ComponentLink1URL: https://www.bourns.com/docs/product-datasheets/CRxxxxx.pdf; Wattage: 1/8W; Supplier: Digikey; Digikey Part Numer: CR0603-JW-104ELFTR-ND; Supplier 1: Digi-Key; Supplier Part Number 1: 2019-RK73B1JTTD102JCT-ND
R26 = RESISTOR_1K_0603: RES 1k OHM 5% 1/8W 0603; Tolerance: +/- 5%; Made By: Robert Pafford; ComponentLink1Description: Datasheet; ComponentLink1URL: https://www.bourns.com/docs/product-datasheets/CRxxxxx.pdf; Wattage: 1/8W; Supplier: Digikey; Digikey Part Numer: CR0603-JW-104ELFTR-ND; Supplier 1: Digi-Key; Supplier Part Number 1: 2019-RK73B1JTTD102JCT-ND
U1-U6 = LM356MX/NOPB: IC OPAMP JFET 1 CIRCUIT 8SOIC; PartNumber: LM8261M5X/NOPB; Manufacturer: Texas Instruments; Supply Current: 1.3 mA; Supply Voltage: 2.5 V ~ 30 V, +/- 1.25 V ~ 15 V; Gain Bandwidth Product: 21 MHz; Created By: Dylan T; ComponentLink1Description: Digi-Key; ComponentLink1URL: https://www.digikey.com/en/products/detail/texas-instruments/LF356MX-NOPB/366701
U7 U8 = LT5560EDD: RF Mixer IC CATV, DBS, PHS, UHF, VHF Up/Down Converter 10kHz ~ 4GHz 8-DFN (3x3)

## Sheet Acoustics Board Power.SchDoc: Sample Sheet Title
size B; Date: MM/DD/YYYY; Author: Sample Author; Organization: ORGANIZATION; Address1: ADDRESS 1; Address2: ADDRESS 2; Address3: ADDRESS 3; Address4: ADDRESS 4; Revision: -; SheetNumber: 3; SheetTotal: 5; ENG_APP_DATE: --/--/--; DSN_APP_DATE: --/--/--; CHK_APP_DATE: --/--/--
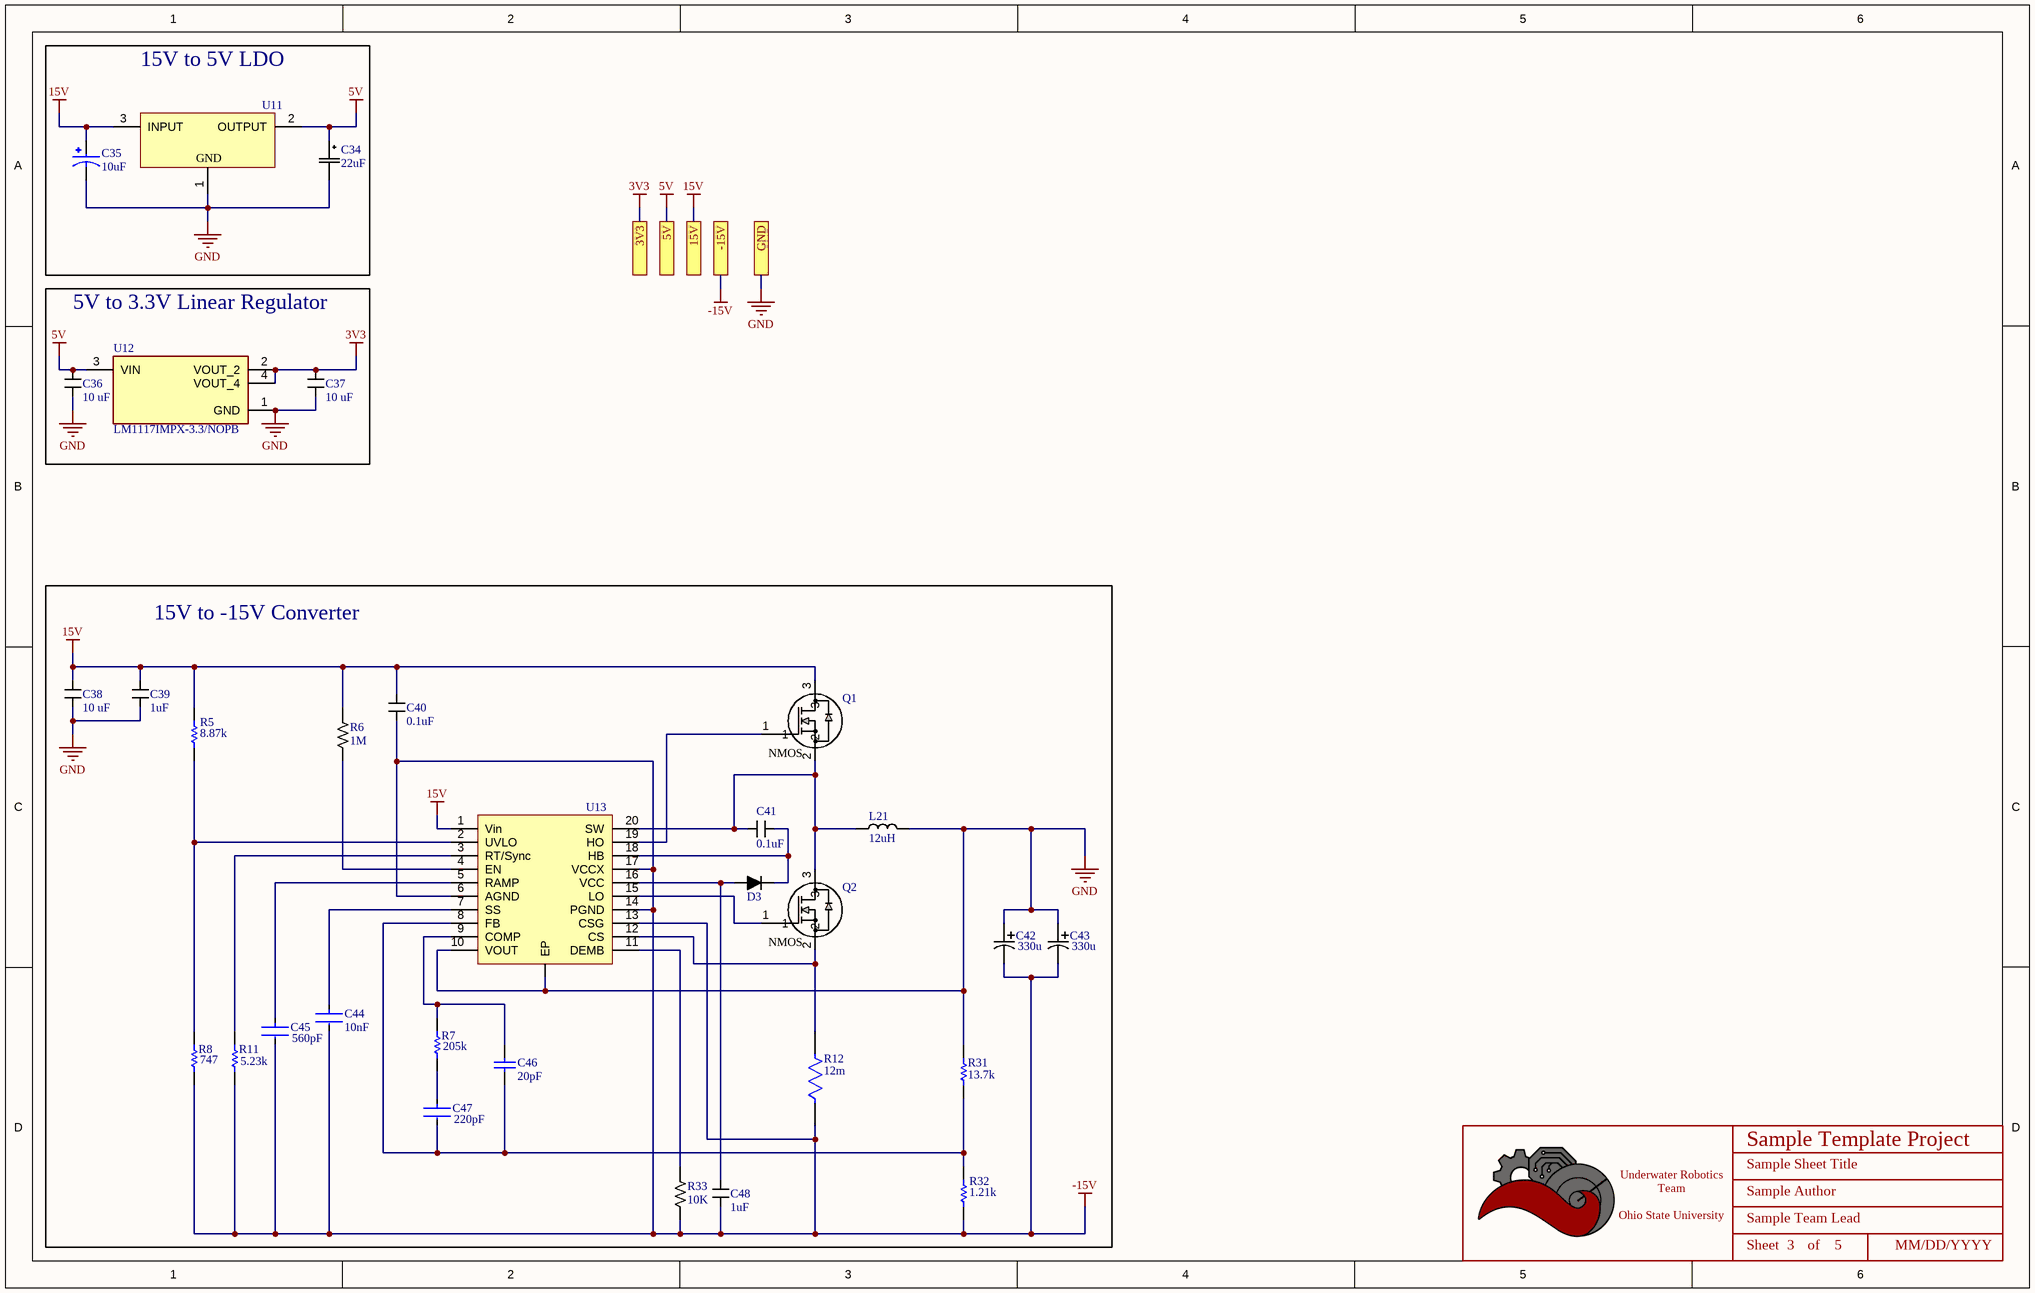
[diagram p2: Acoustics Board Power.SchDoc]

### Parts
(Parts that share a designator on the sheet are numbered #1, #2 ... from top to bottom, then left to right.)
*#3  Title_Block  [LOGO]  (value not drawn)  (graphical)
C34  value 22uF  [PCAP_8x5.4-ELECT_NCA]  (hidden comment: 22uF electrolytic 35 V)
C35  value 10uF  [CAP_EEHZC1J100P]  (hidden comment: 10uF electrolytic 63V)
C36  Value (uF): 10 uF  [CAPACITOR_0603]  (hidden comment: 10uF Ceramic 6.3V)
C37  Value (uF): 10 uF  [CAPACITOR_0603]  (hidden comment: 10uF Ceramic 6.3V)
C38  Value (uF): 10 uF  [CAPACITOR_0603]  (hidden comment: 10uF Ceramic 6.3V)
C39  value 1uF  [CAPACITOR_0402]  (hidden comment: 1uF Ceramic 16V)
C40  value 0.1uF  [CAPACITOR_0402]  (hidden comment: 100nF Ceramic 25V)
C41  value 0.1uF  [CAPACITOR_0402]  (hidden comment: 100nF Ceramic 25V)
C42  Capacitance: 330u  [PCAP_EEHZ_G_PAN]  (hidden comment: EEH-ZC1E331P)
C43  Capacitance: 330u  [PCAP_EEHZ_G_PAN]  (hidden comment: EEH-ZC1E331P)
C44  10nF  [CAPACITOR_0402]
C45  Capacitance: 560pF  [FP-CL10-IPC_C]  (hidden comment: CL10C221JB8NNNC)
C46  Capacitance: 20pF  [CAPC1608X90X30LL10T20]  (hidden comment: CL10C200JB8NNNC)
C47  Capacitance: 220pF  [FP-CL10-IPC_C]  (hidden comment: CL10C221JB8NNNC)
C48  value 1uF  [CAPACITOR_0402]  (hidden comment: 1uF Ceramic 16V)
D3  B330-13-F  [DO-214AB]  (value not drawn)
L21  value 12uH  [INDUCTOR_0603]  (hidden comment: FIXED IND 12UH 10MA 1.8 OHM SMD)
Q1  MOSFET N-Ch 80V 100A D2PAK  [D2PAK]  (value not drawn)
Q2  MOSFET N-Ch 80V 100A D2PAK  [D2PAK]  (value not drawn)
R5  Resistance: 8.87k  [RESC1608X55X25LL10T15]  (hidden comment: RC0603FR-078K87L)
R6  Value  (Ohms): 1M  [RESISTOR_0402]  (hidden comment: 1M Ohm 1% 1/16W)
R7  Resistance: 205k  [RESC1005X40X25ML05T10]  (hidden comment: RC0402FR-07205KL)
R8  Resistance: 747  [RESC1609X50X30NL10T20]  (hidden comment: CRCW0603787RFKEA)
R11  Resistance: 5.23k  [RESC1005X40X25NL05T10]  (hidden comment: RC0402FR-075K23L)
R12  Resistance: 12m  [FP-CSR1206-IPC_B]  (hidden comment: CSR1206FK12L0)
R31  Resistance: 13.7k  [RESC1609X50X30ML10T20]  (hidden comment: CRCW060313K7FKEA)
R32  Resistance: 1.21k  [RESC1608X55X25LL10T15]  (hidden comment: RC0603FR-071K21L)
R33  Value  (Ohms): 10K  [RESISTOR_0603]  (hidden comment: 10k Ohm 0.5% 1/10W)
U11  AZ1117IH-5.0TRG1  [SOT223-3]  (value not drawn)
U12  LM1117IMPX-3.3/NOPB  [SOT-223-4]
U13  LM25116  [LM25116]  (value not drawn)

### Blocks framed on the sheet
15V to 5V LDO: C34 C35 U11
5V to 3.3V Linear Regulator: C36 C37 U12
15V to -15V Converter: C38-C48 D3 L21 Q1 Q2 R5-R8 R11 R12 R31-R33 U13

### Ports
3V3, 5V, 15V, -15V, GND

### Nets
3V3: C37.1 U12.2(VOUT_2) U12.4(VOUT_4) ; port 3V3
5V: C34.1 C36.1 U11.2(OUTPUT) U12.3(VIN) ; port 5V
15V: C35.1 C38.1 C39.1 C40.1 Q1.3 R5.1 R6.1 U11.3(INPUT) U13.1(Vin) ; port 15V
-15V: C40.2 C42.2 C43.2 C44.2 C45.2 C48.2 R8.1 R11.1 R12.1 R32.2 R33.2 U13.6(AGND) U13.13(CSG) U13.14(PGND) U13.17(VCCX) ; port -15V
GND: C34.2 C35.2 C36.2 C37.2 C38.2 C39.2 C42.1 C43.1 L21.1 R31.2 U11.1(GND) U12.1(GND) U13.10(VOUT) U13.21(EP) ; port GND
NetC41_1: C41.1 L21.2 Q1.2 Q2.3 U13.20(SW)
NetC41_2: C41.2 D3.2 U13.18(HB)
NetC44_1: C44.1 U13.7(SS)
NetC45_1: C45.1 U13.5(RAMP)
NetC46_1: C46.1 R7.2 U13.9(COMP)
NetC46_2: C46.2 C47.2 R31.1 R32.1 U13.8(FB)
NetC47_1: C47.1 R7.1
NetC48_1: C48.1 D3.1 U13.16(VCC)
NetQ1_1: Q1.1 U13.19(HO)
NetQ2_1: Q2.1 U13.15(LO)
NetQ2_2: Q2.2 R12.2 U13.12(CS)
NetR5_2: R5.2 R8.2 U13.2(UVLO)
NetR6_2: R6.2 U13.4(EN)
NetR11_2: R11.2 U13.3(RT/Sync)
NetR33_1: R33.1 U13.11(DEMB)

### Notes on the sheet
- DWG. NO.
- REV.
- SHT.
- THIS DOCUMENT AND THE DATA DISCLOSED HEREIN OR HEREWITH IS THE PROPERTY OF ALTIUM LIMITED AND MAY BE FREELY DISTRIBUTED IN WHOLE. NO RIGHTS ARE RESERVED OR EXPRESS OR IMPLIED WARANTEE GIVEN.
- REVISION
- DESCRIPTION
- DATE
- APPROVED
- ENG:
- APPROVALS
- PROJECT
- DSN:
- CHK:
- REFERENCE DOCUMENTS
- PROJECT REVISION:
- TITLE
- DOCUMENT REVISION:
- DESIGN ITEM:
- BOM:
- FAB DWG:
- PCB DWG:
- ASSY DWG:
- SCALE:
- SIZE
- B
- CAGE CODE
- FILE NAME
- DWG NO.
- SHEET
- OF
- REV
- (in symbol PSMN4R4-80BS,118) NMOS
- (in symbol Title_Block) Underwater Robotics Team / Ohio State University; Sheet; of

### Library data of the parts
*#3 = Title_Block: as *#1 on sheet Acoustics Board Pg. 2
C34 = CAP ALUM 22UF 20% 35V SMD: 22 µF 35 V Aluminum Electrolytic Capacitors Radial, Can - SMD 1000 Hrs; Made by: Robert Pafford; Voltage: 35V; Supplier 1: Digi-Key; Supplier Part Number 1: PCE3952DKR-ND
C35 = CAP ALUM 10UF 20% 63V SMD: 10 µF 63 V Aluminum - Polymer Capacitors Radial, Can SMD 120mOhm; Made by: Robert Pafford; Tolerance: +/- 20%; Max Voltage: 63V; Supplier 1: Digi-Key; Supplier Part Number 1: P15466CT-ND
C36-C38 = CAPACITOR_10uF_0603: as C27 on sheet Acoustics Board Pg. 2; ComponentLink1Description: Digikey; ComponentLink1URL: https://www.digikey.com/en/products/detail/samsung-electro-mechanics/CL10A106MQ8NNNC/3886777; Supplier 1: Digi-Key; Supplier Part Number 1: 1276-1119-1-ND; Tolerance: +/- 20%; Voltage: 6.3V
C39 C48 = CAPACITOR_1uF_0402: Cap 1uF 16V +/-10% / Ceramic 0402; Made By: Robert Pafford; Tolerance: +/- 10%; Voltage: 16V; Supplier 1: Digi-Key; Supplier Part Number 1: 478-0402YD105KAT4ADKR-ND
C40 C41 = CAPACITOR_0.1uF_0402: Cap 100nF 25V +/-10% / Ceramic 0402; Made By: Robert Pafford; Tolerance: +/- 10%; Voltage: 25V; Supplier 1: Digi-Key; Supplier Part Number 1: 478-7868-1-ND
C42 C43 = EEH-ZC1E331P: No Description Available; Mfr_Name: Panasonic; Type: DEV; Copyright: Copyright (C) 2024 Ultra Librarian. All rights reserved.; Manufacturer_Part_Number: EEH-ZC1E331P; RefDes: RefDes
C44 = CAP CER 0.01 UF 0402: CAP CER 10000PF 50V X7R 0402; Manufacturer Part Number: CC0402KRX7R9BB103; Manufacturer: YAGEO; Temperature Coefficient: 30ppm/°C; Material: Ceramic; Automotive Grade: NA; Tolerance: 0.1; Device Class L3: Ceramic Capacitors; Temperature: -55°C to +125°C; Footprint Url: http://www.yageo.com/exep/pages/download/literatures/UPY-C_GEN_24.pdf; Ipc Land Pattern Name: CAPC10050X50; Device Class L1: Passive Components; Automotive: No; Octopart: https://octopart.com/cc0402krx7r9bb103-yageo-8376513; Lead Free: Yes; Temperature Range Low: -55°C; Height: 0.55mm; ComponentLink2URL: http://www.yageo.com/documents/recent/UPY-GP_NP0_16V-to-50V_16.pdf; Capacitance: 10 nF; Category: Cap; ComponentLink2Description: Datasheet; Temperature Range High: +125°C; Digikey Description: CAP CER 10000PF 50V X7R 0402; Voltage Rating: 50 V; Package: CC0402; Device Class L2: Capacitors; Mouser Description: 0402 10 nF 50 V ±10 % Tolerance X7R SMT Multilayer Ceramic Capacitor; Value: 10 nF; RoHS: TRUE; Temperature Characteristic: X7R; Supplier 1: Future Electronics; Supplier Part Number 1: 8570871
C45 C47 = CMP-13271-002543-1: Cap Ceramic 220pF 50V C0G ±5% Pad SMD 0603 +125°C T/R; Temperature Coefficient: 300ppm/°C; Contact Plating: Tin; Voltage Rating (DC): 50V; Case/Package: 0603; Case Code (Metric): 1608; Length: 1.6mm; Depth: 0.8mm; Package Quantity: 1; Lead Free: Lead Free; Mount: Surface Mount; Min Operating Temperature: -55°C; Voltage: 50V; Case Code (Imperial): 0603; Radiation Hardening: No; Max Operating Temperature: 125°C; Material: Ceramic; Dielectric: C0G; Voltage Rating: 50V; Width: 0.031inch; Thickness: 0.035inch; Height: 0.8mm; Packaging: Tape and Reel; Tolerance: 5%
C46 = CMP-2000-06100-1: Chip Capacitor, 20 pF, +/- 5%, 50 V, -55 to 85 degC, 0603 (1608 Metric), RoHS, Tape and Reel; Manufacturer: Samsung Electro-Mechanics; Dielectric: C0G; Rated Voltage: 50V; Tolerance (%): ±5%; Case Size/Dimension: 0603; Datasheet Version: 06/2016; Manufacturer URL: http://www.samsungsem.com/global/index.jsp; Datasheet URL: http://www.samsungsem.com/kr/support/product-search/mlcc/__icsFiles/afieldfile/2016/08/18/S_CL10C200JB8NNNC.pdf; Mounting Technology: SurfaceMount; Package Description: 2-Pin Surface Mount Device, Body 1.60 x 0.80 mm; Package Reference: 0603
D3 = SCHOTTKY_30V_3A: Schottky Diode, 30V reverse breakdown, 3A, Vf = 0.500V; Made By: Tyson N.; Forward Voltage: 500mV; ComponentLink1Description: Datasheet; ComponentLink1URL: https://www.onsemi.com/pdf/datasheet/mbr0520lt1-d.pdf; Forward Current: 3A; Package: DO-214AB; Supplier 1: RSComponents; Supplier Part Number 1: 7513269
L21 = INDUCTOR_12uH_0603: as L5 on sheet Acoustics Board Sheet 1; Supplier 1: Arrow Electronics; Supplier Part Number 1: MLF1608E120JTD25
Q1 Q2 = PSMN4R4-80BS,118: N-Channel 80V 100A (Ta) 306W (Ta), Surface Mount D2PAK; Vendor: Nexperia USA Inc.; Vgs (Max): +/- 20 V; Vgs (th): 3V; Rds (on): 3.8mOhm @ 25A, 10Vgs; Amp Rating: 100A; FET Type: N-Channel; Package: D2PAK; Manufacturer _Part_Number: PSMN4R4-80BS,118; Vdss: 80 V; Power Dissipation: 306W; Created By: Flip B; Supplier 1: Digi-Key; Supplier Part Number 1: 1727-7123-1-ND
R5 = CMP-2000-03933-1: Manufacturer: Yageo; Part Number: RC0603FR-071K21L
R6 = RESISTOR_1M_0402: RES 1M OHM 1% 1/16W 0402; Tolerance: +/- 1%; Made By: Robert Pafford; Wattage: 1/16W; Supplier 1: Digikey; Supplier Part Number 1: YAG3450CT-ND
R7 = CMP-1011-00769-2: Manufacturer: Yageo / Phycomp; Part Number: RC0402FR-07205KL
R8 = CMP-2000-03578-1: Manufacturer: Vishay Dale; Part Number: CRCW0603787RFKEA
R11 = CMP-2002-06960-1: Manufacturer: Yageo; Part Number: RC0402FR-075K23L
R12 = CMP-26527-002803-1: General Purpose Thick Film Chip Resistor, 1206, 12mΩ, 1%, 0.5W; Temperature Coefficient: 100ppm/°C; Max Power Dissipation: 500mW; Case/Package: 1206; Case Code (Imperial): 1206; Series: CSR; Max Operating Temperature: 155°C; Contact Plating: Tin; Min Operating Temperature: -55°C; Length: 0.12inch; Tolerance: 1%; Width: 0.061inch; Packaging: Tape and Reel; Military Standard: Not; Lead Free: Lead Free; Construction: Rectangular; Depth: 1.55mm; Mount: Surface Mount; RoHS Compliant: Yes; Case Code (Metric): 3216; Resistor Type: Thick Film; Number of Terminations: 2; Height: 0.026inch
R31 = CMP-2000-03899-1: Manufacturer: Vishay Dale; Part Number: CRCW060313K7FKEA
R32 = CMP-2000-03933-1: Manufacturer: Yageo; Part Number: RC0603FR-071K21L
R33 = RESISTOR_10K_0.5%_0603: as R9 on sheet Acoustics Board Sheet 1; Wattage: 1/10W; Supplier: Digikey; Digikey Part Numer: CR0603-JW-104ELFTR-ND; Supplier 1: Digi-Key; Supplier Part Number 1: 749-1695-1-ND
U11 = AZ1117IH-5.0TRG1: Linear Voltage Regulator IC Positive Fixed 1 Output 1A SOT-223-3
U12 = LM1117IMPX-3.3/NOPB: 800-mA 15-V linear voltage regulator 4-SOT-223 -40 to 125; MF: Texas Instruments; Texas_Instruments-Purchase-URL: https://snapeda.com/shop?store=Texas+Instruments&id=410186; Price: None; Mouser-Purchase-URL: https://snapeda.com/shop?store=Mouser&id=410186; MP: LM1117IMPX-3.3/NOPB; Value: *; Availability: Good; Package: SOT-223-4 Texas Instruments; Arrow_Electronics-Purchase-URL: https://snapeda.com/shop?store=Arrow+Electronics&id=410186; SnapEDA_Link: https://www.snapeda.com/parts/LM1117IMPX-3.3/NOPB/Texas%20Instruments/view-part/410186/?ref=snap; DigiKey-Purchase-URL: https://snapeda.com/shop?store=DigiKey&id=410186
U13 = LM25116: IC REG CTRLR BUCK 20TSSOP

## Nets that join several sheets
3V3: Acoustics Board Pg. 2 (15 pins), Acoustics Board Sheet 1 (12 pins), Acoustics Board Power (C37.1 U12.2 U12.4)
5V: Acoustics Board Pg. 2 (J6.1), Acoustics Board Power (C34.1 C36.1 U11.2 U12.3)
15V: Acoustics Board Pg. 2 (J1.3 J2.3 TP16.TP), Acoustics Board Sheet 1 (6 pins), Acoustics Board Power (9 pins)
-15V: Acoustics Board Sheet 1 (6 pins), Acoustics Board Power (15 pins)
GND: Acoustics Board Pg. 2 (44 pins), Acoustics Board Sheet 1 (34 pins), Acoustics Board Power (14 pins)
Envelope Detector L: Acoustics Board Pg. 2 (D1.1), Acoustics Board Sheet 1 (R13.2 U3.6)
Envelope Detector R: Acoustics Board Pg. 2 (D2.1), Acoustics Board Sheet 1 (R14.2 U4.6)
Hydrophone L: Acoustics Board Pg. 2 (J3.2 TP15.TP), Acoustics Board Sheet 1 (R23.2)
Hydrophone R: Acoustics Board Pg. 2 (J4.2 TP17.TP), Acoustics Board Sheet 1 (R24.2)
Local Oscillator: Acoustics Board Pg. 2 (C33.2 TP13.TP), Acoustics Board Sheet 1 (C49.1 C50.1)